# Altium schematic sheet BDAN_TFT.SchDoc
size A4; SheetNumber: 4; SheetTotal: 5
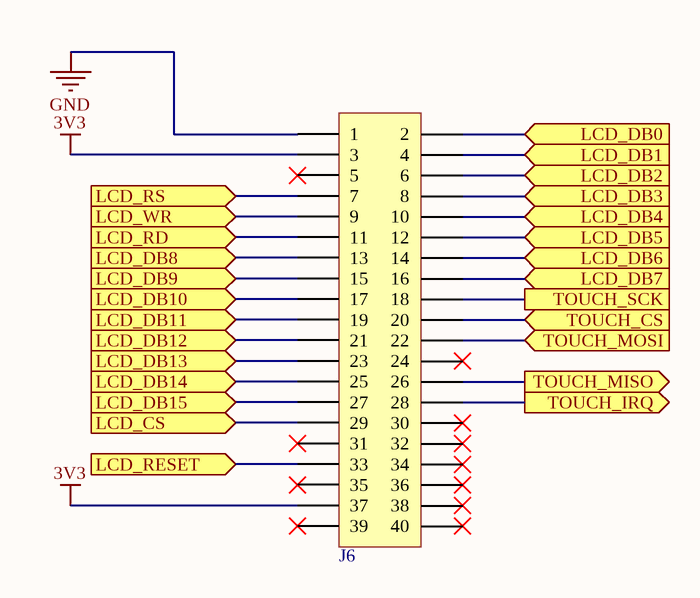
[diagram p0: BDAN_TFT.SchDoc]

## Parts
J6  ILI9341  [ILI9341]  (value not drawn)

## Ports
LCD_CS (in), LCD_DB0 (in), LCD_DB1 (in), LCD_DB2 (in), LCD_DB3 (in), LCD_DB4 (in), LCD_DB5 (in), LCD_DB6 (in), LCD_DB7 (in), LCD_DB8 (in), LCD_DB9 (in), LCD_DB10 (in), LCD_DB11 (in), LCD_DB12 (in), LCD_DB13 (in), LCD_DB14 (in), LCD_DB15 (in), LCD_RD (in), LCD_RESET (in), LCD_RS (in), LCD_WR (in), TOUCH_CS (in), TOUCH_IRQ (out), TOUCH_MISO (out), TOUCH_MOSI (in), TOUCH_SCK

## Nets
3V3: J6.3 J6.37
GND: J6.1
LCD_CS: J6.29 ; port LCD_CS
LCD_DB0: J6.2 ; port LCD_DB0
LCD_DB1: J6.4 ; port LCD_DB1
LCD_DB2: J6.6 ; port LCD_DB2
LCD_DB3: J6.8 ; port LCD_DB3
LCD_DB4: J6.10 ; port LCD_DB4
LCD_DB5: J6.12 ; port LCD_DB5
LCD_DB6: J6.14 ; port LCD_DB6
LCD_DB7: J6.16 ; port LCD_DB7
LCD_DB8: J6.13 ; port LCD_DB8
LCD_DB9: J6.15 ; port LCD_DB9
LCD_DB10: J6.17 ; port LCD_DB10
LCD_DB11: J6.19 ; port LCD_DB11
LCD_DB12: J6.21 ; port LCD_DB12
LCD_DB13: J6.23 ; port LCD_DB13
LCD_DB14: J6.25 ; port LCD_DB14
LCD_DB15: J6.27 ; port LCD_DB15
LCD_RD: J6.11 ; port LCD_RD
LCD_RESET: J6.33 ; port LCD_RESET
LCD_RS: J6.7 ; port LCD_RS
LCD_WR: J6.9 ; port LCD_WR
TOUCH_CS: J6.20 ; port TOUCH_CS
TOUCH_IRQ: J6.28 ; port TOUCH_IRQ
TOUCH_MISO: J6.26 ; port TOUCH_MISO
TOUCH_MOSI: J6.22 ; port TOUCH_MOSI
TOUCH_SCK: J6.18 ; port TOUCH_SCK

Not connected (* = marked no-connect by the designer): J6 5* 24* 30* 31* 32* 34* 35* 36* 38* 39* 40*

## Library data of the parts
J6 = ILI9341-3.2: ILI9341-3.2''; Publico: JP; Part Number: ILI9341-3.2; Value: ILI9341; Aprobo: -